# EAGLE design ESP32-S2_Thing_Plus (EAGLE 9.6.2)
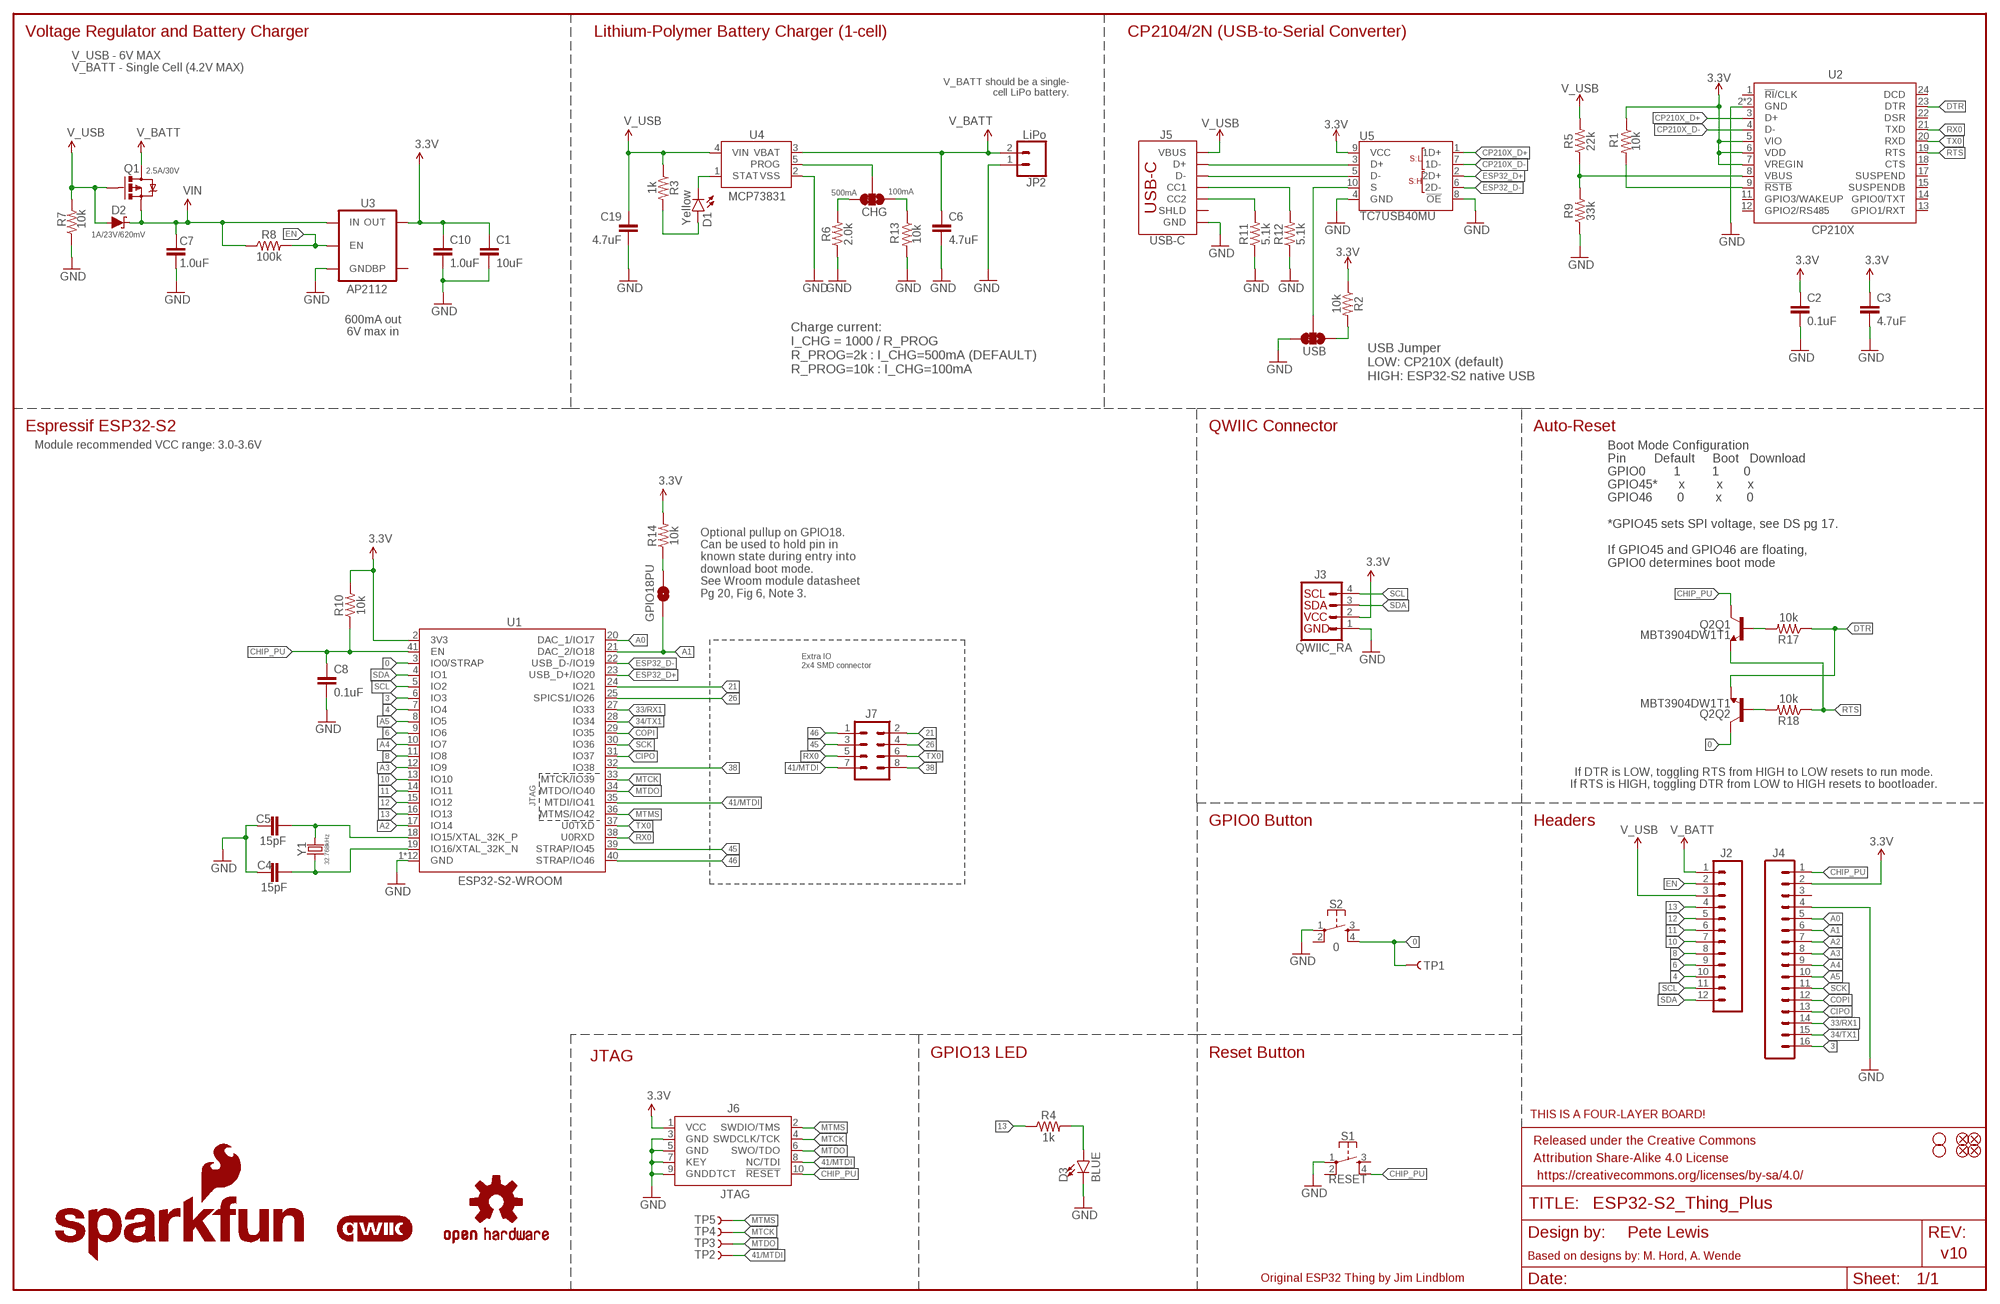
[diagram p0: schematic, sheet 1]

## Parts
C1  10uF  10UF-0402T-6.3V-20%  [0402-TIGHT]
C2  0.1uF  0.1UF-0402T-16V-10%  [0402-TIGHT]
C3  4.7uF  4.7UF-0402_TIGHT-6.3V-20%-X5R  [0402-TIGHT]
C4  15pF  15PF-0402T-50V-5%  [0402-TIGHT]
C5  15pF  15PF-0402T-50V-5%  [0402-TIGHT]
C6  4.7uF  4.7UF-0402_TIGHT-6.3V-20%-X5R  [0402-TIGHT]
C7  1.0uF  1.0UF-0402T-16V-10%  [0402-TIGHT]
C8  0.1uF  0.1UF-0402T-16V-10%  [0402-TIGHT]
C10  1.0uF  1.0UF-0402T-16V-10%  [0402-TIGHT]
C19  4.7uF  4.7UF-0402_TIGHT-6.3V-20%-X5R  [0402-TIGHT]
CHG  JUMPER-SMT_3_1-NC_TRACE_SILK  [SMT-JUMPER_3_1-NC_TRACE_SILK]
D1  Yellow  LED-YELLOW0603  [LED-0603]
D2  1A/23V/620mV  DIODE-SCHOTTKY-BAT20J  [SOD-323]
D3  BLUE  LED-BLUE0603  [LED-0603]
FD1  FIDUCIALUFIDUCIAL  [FIDUCIAL-MICRO]
FD2  FIDUCIALUFIDUCIAL  [FIDUCIAL-MICRO]
FD3  FIDUCIALUFIDUCIAL  [FIDUCIAL-MICRO]
FD4  FIDUCIALUFIDUCIAL  [FIDUCIAL-MICRO]
FRAME1  FRAME-LEDGER  [CREATIVE_COMMONS]
GPIO18PU  JUMPER-SMT_2_NO_SILK  [SMT-JUMPER_2_NO_SILK]
H1  STAND-OFF  [STAND-OFF]
H2  STAND-OFF  [STAND-OFF]
J2  CONN_12SM_SQ_NO_SILK  [1X12_SM_SQ_NOSILK]
J3  QWIIC_RA  QWIIC_CONNECTORJS-1MM  [JST04_1MM_RA]
J4  CONN_161X16_SM_SQ_NOSILK  [1X16_SM_SQ_NOSILK]
J5  USB-C  USB_C_4-LAYER-ISOLATED  [USB-C-16P-4LAYER-ISOLATED]
J6  JTAG  CORTEX_JTAG_DEBUG_PTH_NS  [2X5-PTH-1.27MM-NO_SILK]
J7  CONN_04X2_SMT_NO_POSTS_NS  [2X4_SMT_NO_POSTS_NS]
JP2  LiPo  CONN_02-JST-2MM-SMT  [JST-2-SMD]
LOGO1  SFE_LOGO_FLAME.1_INCH  [SFE_LOGO_FLAME_.1]
LOGO2  OSHW-LOGOMINI  [OSHW-LOGO-MINI]
LOGO3  SFE_LOGO_NAME_FLAME.1_INCH  [SFE_LOGO_NAME_FLAME_.1]
LOGO4  FOUR_LAYER_WARNING  [FOUR_LAYER_WARNING]
LOGO6  QWIIC_LOGO_4MM  [QWIIC_4MM]
Q1  2.5A/30V  MOSFET-PCHANNELDMG2307L  [SOT23-3@1]
Q2  MBT3904DW1T1  TRANS_NPN_DUAL-MBT3904DW1T1  [SC70-6]
R1  10k  10KOHM-0402T-1/16W-1%  [0402-TIGHT]
R2  10k  10KOHM-0402T-1/16W-1%  [0402-TIGHT]
R3  1k  1KOHM-0402T-1/16W-1%  [0402-TIGHT]
R4  1k  1KOHM-0402T-1/16W-1%  [0402-TIGHT]
R5  22k  22KOHM-0402_TIGHT-1/10W-1%  [0402-TIGHT]
R6  2.0k  2.0KOHM1/10W5%(0603)  [0603]
R7  10k  10KOHM-0402T-1/16W-1%  [0402-TIGHT]
R8  100k  100KOHM-0402T-1/16W-1%  [0402-TIGHT]
R9  33k  33KOHM-0402T-1/16W-1%  [0402-TIGHT]
R10  10k  10KOHM-0402T-1/16W-1%  [0402-TIGHT]
R11  5.1k  5.1KOHM-0402T-1/16W-1%  [0402-TIGHT]
R12  5.1k  5.1KOHM-0402T-1/16W-1%  [0402-TIGHT]
R13  10k  10KOHM-0402T-1/16W-1%  [0402-TIGHT]
R14  10k  10KOHM-0402T-1/16W-1%  [0402-TIGHT]
R17  10k  10KOHM-0402T-1/16W-1%  [0402-TIGHT]
R18  10k  10KOHM-0402T-1/16W-1%  [0402-TIGHT]
S1  RESET  MOMENTARY-SWITCH-SPST-2-SMD-4.6X2.8MM  [TACTILE_SWITCH_SMD_4.6X2.8MM]
S2  0  MOMENTARY-SWITCH-SPST-2-SMD-4.6X2.8MM  [TACTILE_SWITCH_SMD_4.6X2.8MM]
TP1  TEST-POINTTP_15TH_THRU  [TP_15TH]
TP2  TEST-POINT3X4  [PAD.03X.04]
TP3  TEST-POINT3X4  [PAD.03X.04]
TP4  TEST-POINT3X4  [PAD.03X.04]
TP5  TEST-POINT3X4  [PAD.03X.04]
U1  ESP32-S2-WROOM  [ESP32-S2-WROOM]
U2  CP210X  CP2102N  [QFN24]
U3  AP2112  V_REG_LDOSMD  [SOT23-5]
U4  MCP73831  [SOT23-5]
U5  TC7USB40MU  [UQFN10]
USB  JUMPER-SMT_3_1-NC_TRACE_SILK  [SMT-JUMPER_3_1-NC_TRACE_SILK]
Y1  32.768kHz  CRYSTAL-32.768KHZSMD-3.2X1.5  [CRYSTAL-SMD-3.2X1.5MM]

## Nets
0: Q2.6(Q2:C) S2.4 TP1.P$1 U1.3(IO0/STRAP)
3: J4.16 U1.6(IO3)
3.3V: C1.1 C2.1 C3.1 C10.1 J3.2 J4.2 J6.1(VCC) R1.1 R2.1 R10.2 R14.2 U1.2(3V3) U2.5(VIO) U2.6(VDD) U2.7(VREGIN) U3.5(OUT) U5.9(VCC)
4: J2.10 U1.7(IO4)
6: J2.9 U1.9(IO6)
8: J2.8 U1.11(IO8)
10: J2.7 U1.13(IO10)
11: J2.6 U1.14(IO11)
12: J2.5 U1.15(IO12)
13: J2.4 R4.1 U1.16(IO13)
21: J7.2 U1.24(IO21)
26: J7.4 U1.25(SPICS1/IO26)
33/RX1: J4.14 U1.27(IO33)
34/TX1: J4.15 U1.28(IO34)
38: J7.8 U1.32(IO38)
41/MTDI: J6.8(NC/TDI) J7.7 TP2.P$1 U1.35(MTDI/IO41)
45: J7.3 U1.39(STRAP/IO45)
46: J7.1 U1.40(STRAP/IO46)
A0: J4.5 U1.20(DAC_1/IO17)
A1: GPIO18PU.1 J4.6 U1.21(DAC_2/IO18)
A2: J4.7 U1.17(IO14)
A3: J4.8 U1.12(IO9)
A4: J4.9 U1.10(IO7)
A5: J4.10 U1.8(IO5)
CC1: J5.A5(CC1) R12.2
CC2: J5.B5(CC2) R11.2
CHG: D1.C U4.1(STAT)
CHIP_PU: C8.1 J4.1 J6.10(!RESET) Q2.3(Q1:C) R10.1 S1.4 U1.41(EN)
CIPO: J4.13 U1.31(IO37)
COPI: J4.12 U1.29(IO35)
CP210X_D+: U2.3(D+) U5.1(1D+)
CP210X_D-: U2.4(D-) U5.7(1D-)
DTR: Q2.1(Q2:E) R17.1 U2.23(DTR)
EN: J2.2 R8.2 U3.3(EN)
ESP32_D+: U1.23(USB_D+/IO20) U5.2(2D+)
ESP32_D-: U1.22(USB_D-/IO19) U5.6(2D-)
GND: C1.2 C2.2 C3.2 C4.1 C5.1 C6.2 C7.2 C8.2 C10.2 C19.2 D3.C J3.1 J4.4 J5.GND J5.GND2(GND) J6.3(GND) J6.5(GND) J6.7(KEY) J6.9(GNDDTCT) JP2.1 R6.1 R7.1 R9.1 R11.1 R12.1 R13.2 S1.1 S2.1 U1.1(GND) U1.26(GND) U1.42(GND) U1.GNDEP0(GND) U1.GNDEP1(GND) U1.GNDEP2(GND) U1.GNDEP3(GND) U1.GNDEP4(GND) U1.GNDEP5(GND) U1.GNDEP6(GND) U1.GNDEP7(GND) U1.GNDEP8(GND) U2.2(GND) U2.PAD(GND) U3.2(GND) U4.2(VSS) U5.4(GND) U5.8(!OE!) USB.3
MTCK: J6.4(SWDCLK/TCK) TP4.P$1 U1.33(MTCK/IO39)
MTDO: J6.6(SWO/TDO) TP3.P$1 U1.34(MTDO/IO40)
MTMS: J6.2(SWDIO/TMS) TP5.P$1 U1.36(MTMS/IO42)
N$1: R1.2 U2.9(!RSTB)
N$2: D3.A R4.2
N$3: J5.A6(D+) J5.B6(D+) U5.3(D+)
N$4: R5.1 R9.2 U2.8(VBUS)
N$5: J5.A7(D-) J5.B7(D-) U5.5(D-)
N$6: R2.2 USB.1
N$7: C5.2 U1.18(IO15/XTAL_32K_P) Y1.P$2
N$8: C4.2 U1.19(IO16/XTAL_32K_N) Y1.P$1
N$9: CHG.2 U4.5(PROG)
N$10: Q2.5(Q1:B) R17.2
N$11: CHG.1 R13.1
N$12: Q2.2(Q2:B) R18.2
N$13: CHG.3 R6.2
N$14: GPIO18PU.2 R14.1
N$17: D1.A R3.2
RTS: Q2.4(Q1:E) R18.1 U2.19(RTS)
RX0: J7.5 U1.38(U0RXD) U2.21(TXD)
SCK: J4.11 U1.30(IO36)
SCL: J2.11 J3.4 U1.5(IO2)
SDA: J2.12 J3.3 U1.4(IO1)
TX0: J7.6 U1.37(U0TXD) U2.20(RXD)
USB_SEL: U5.10(S) USB.2
V_BATT: C6.1 J2.1 JP2.2 Q1.3(D) U4.3(VBAT)
V_USB: C19.1 D2.A J2.3 J5.VBUS1(VBUS) J5.VBUS2(VBUS) Q1.1(G) R3.1 R5.2 R7.2 U4.4(VIN)
VIN: C7.1 D2.C Q1.2(S) R8.1 U3.1(IN)
Unconnected: J4.3 J5.SHLD1(SHLD) J5.SHLD2(SHLD) J5.SHLD3(SHLD) J5.SHLD4(SHLD) J5.SHLD5(SHLD) J5.SHLD6(SHLD) J5.SHLD7(SHLD) J5.SHLD8(SHLD) S1.2 S1.3 S2.2 S2.3 U2.1(!RI!/CLK) U2.11(GPIO3/WAKEUP) U2.12(GPIO2/RS485) U2.13(GPIO1/RXT) U2.14(GPIO0/TXT) U2.15(SUSPENDB) U2.17(SUSPEND) U2.18(CTS) U2.22(DSR) U2.24(DCD) U3.4(BP)

## Notes on the sheet
- Voltage Regulator and Battery Charger | Lithium-Polymer Battery Charger (1-cell) | CP2104/2N (USB-to-Serial Converter)
- V_USB - 6V MAX
  V_BATT - Single Cell (4.2V MAX)
- V_BATT should be a single-
  cell LiPo battery.
- 500mA | 100mA
- 600mA out
  6V max in
- Charge current:
  I_CHG = 1000 / R_PROG
  R_PROG=2k : I_CHG=500mA (DEFAULT)
  R_PROG=10k : I_CHG=100mA
- USB Jumper
  LOW: CP210X (default)
  HIGH: ESP32-S2 native USB
- Espressif ESP32-S2 | QWIIC Connector | Auto-Reset
- Module recommended VCC range: 3.0-3.6V
- Boot Mode Configuration
  Pin        Default     Boot   Download
  GPIO0        1         1       0
  GPIO45*      x         x       x 
  GPIO46       0         x       0
  
  *GPIO45 sets SPI voltage, see DS pg 17.
  
  If GPIO45 and GPIO46 are floating, 
  GPIO0 determines boot mode
- Optional pullup on GPIO18.
  Can be used to hold pin in 
  known state during entry into
  download boot mode. 
  See Wroom module datasheet
  Pg 20, Fig 6, Note 3.
- Extra IO 
  2x4 SMD connector
- If DTR is LOW, toggling RTS from HIGH to LOW resets to run mode.
  If RTS is HIGH, toggling DTR from LOW to HIGH resets to bootloader.
- GPIO0 Button | Headers
- JTAG | GPIO13 LED | Reset Button
- Pete Lewis
- v10
- Based on designs by: M. Hord, A. Wende
- Original ESP32 Thing by Jim Lindblom

## Library data of the parts
C1 = SparkFun-Capacitors:10UF: 10.0µF ceramic capacitors A capacitor is a passive two-terminal electrical component used to store electrical energy temporarily in an electric field.; PROD_ID: CAP-14848
C2 C8 = SparkFun-Capacitors:0.1UF: 0.1µF ceramic capacitors A capacitor is a passive two-terminal electrical component used to store electrical energy temporarily in an electric field.; PROD_ID: CAP-12416
C3 C6 C19 = SparkFun-Capacitors:4.7UF: 4.7µF ceramic capacitors A capacitor is a passive two-terminal electrical component used to store electrical energy temporarily in an electric field.; PROD_ID: CAP-14240
C4 C5 = SparkFun-Capacitors:15PF: 15pF ceramic capacitors A capacitor is a passive two-terminal electrical component used to store electrical energy temporarily in an electric field.; PROD_ID: CAP-13063
C7 C10 = SparkFun-Capacitors:1.0UF: 1µF ceramic capacitors A capacitor is a passive two-terminal electrical component used to store electrical energy temporarily in an electric field.; PROD_ID: CAP-12417
CHG USB = SparkFun-Jumpers:JUMPER-SMT_3_1-NC_TRACE: Normally closed trace jumper (1 of 2 connections) This jumper has a trace between two pads so it's normally closed (NC). The other connection is normally open (NO). Use a razor knife to open the connection. For best results follow the IPC guidelines for cutting traces: Cutout at least 0.063 mm (0.005 in). Remove all loose material to clean up the cut area. Seal the cut with an approved epoxy. Reapply solder to reclose the connection, or to close the NO connection.
D1 = SparkFun-LED:LED-YELLOW: Yellow SMD LED Used in manufacturing several products at SparkFun. Packages: 0603 - SMD 0603 package[Product Link] <http://www.kingbrightusa.com/product.asp?catalog_name=LED&product_id=APT1608SYCK> 0603 -SMART - SMART SMD 0603 package (more efficient/more expensive) [Product Link] <http://www.osram-os.com/osram_os/en/products/product-catalog/led-light-emitting-diodes/smartled-0603/ly-l29k/index.jsp> LilyPad - SMD1206 package[Product Datasheet] <https://www.sparkfun.com/datasheets/DevTools/LilyPad/Q150YUS4.pdf> SparkFun Products: Blynk Board <https://www.sparkfun.com/products/13794> IOIO-OTG <https://www.sparkfun.com/products/13613> XBee Explorer Serial <https://www.sparkfun.com/products/13225>; PROD_ID: DIO-09003
D2 = SparkFun-DiscreteSemi:DIODE-SCHOTTKY: Schottky diode A Schottky diode is a semiconductor diode which has a low forward voltage drop and a very fast switching action.; PROD_ID: DIO-11623
D3 = SparkFun-LED:LED-BLUE: Blue SMD LED Used in manufacturing of various products at SparkFun Packages: 0603 - SMD 0603 package [Product Link] <http://www.digikey.com/product-detail/en/SMLE12BC7TT86/511-1589-2-ND/1641808> 1206 - SMD1206 package [Product Link] <http://www.digikey.com/product-detail/en/lite-on-inc/LTST-C150TBKT/160-1643-1-ND/573584> SparkFun Products: ESP8266 Thing-Dev Board <https://www.sparkfun.com/products/13711> RedBoard <https://www.sparkfun.com/products/12757>; PROD_ID: DIO-08575
FD1-FD4 = SparkFun-Aesthetics:FIDUCIAL: Fiducial Alignment Points Point-of-reference for pick-and-place machines and other optical instruments.
FRAME1 = SparkFun-Aesthetics:FRAME-LEDGER: Schematic Frame - Ledger Standard 11x14 US Ledger frame
GPIO18PU = SparkFun-Jumpers:JUMPER-SMT_2_NO: Normally open jumper This jumper has two pads in close proximity to each other. Apply solder to close the connection. Round pads are easier to solder for beginners, but are a lot larger. SparkFun Product that uses the round pads: SparkFun EL Sequencer <https://www.sparkfun.com/products/12781>
H1 H2 = SparkFun-Hardware:STAND-OFF: Stand Off Drill holes for mechanically mounting via screws, standoffs, etc. Note: Use the keepout ring to avoid running the screw head into surrounding components. Variant Overviews STAND-OFF - Mechanical footprint for a #4 phillips button head screw. STAND-OFF-TIGHT - Mechanical footprint for a #4 phillips button head screw, Example SparkFun Products Screw - Phillips Head (1/4", 4-40, 10 pack) <https://www.sparkfun.com/products/10453> (PRT-10453) Screw - Phillips Head (1/2", 4-40, 10 pack) <https://www.sparkfun.com/products/10452> (PRT-10452) Screw - Phillips Head (3/4", 4-40, 10 pack) <https://www.sparkfun.com/products/10451> (PRT-10451) Screw - Phillips Head (1", 4-40, 10 pack) <https://www.sparkfun.com/products/10450> (PRT-10450)
J2 = SparkFun-Connectors:CONN_12: Multi connection point. Often used as Generic Header-pin footprint for 0.1 inch spaced/style header connections On any of the 0.1 inch spaced packages, you can populate with these: Break Away Headers - Straight <https://www.sparkfun.com/products/116> (PRT-00116) Break Away Male Headers - Right Angle <https://www.sparkfun.com/products/553> (PRT-00553) Female Headers <https://www.sparkfun.com/products/115> (PRT-00115) Break Away Headers - Machine Pin <https://www.sparkfun.com/products/117> (PRT-00117) Break Away Female Headers - Swiss Machine Pin <https://www.sparkfun.com/products/743> (PRT-00743) For SCREWTERMINALS and SPRING TERMINALS visit here: Screw Terimnals on SparkFun.com <https://www.sparkfun.com/search/results?term=Screw+Terminals> (5mm/3.5mm/2.54mm spacing) This device is also useful as a general connection point to wire up your design to another part of your project. Our various solder wires solder well into these plated through hole pads. Hook-Up Wire - Assortment (Stranded, 22 AWG) <https://www.sparkfun.com/products/11375> (PRT-11375) Hook-Up Wire - Assortment (Solid Core, 22 AWG) <https://www.sparkfun.com/products/11367> (PRT-11367) View the entire wire category on our website here <https://www.sparkfun.com/categories/141> Special notes: Molex polarized connector foot print use with SKU : PRT-08231 with associated crimp pins and housings. 1MM SMD Version SKU: PRT-10208 NOTES ON THE VARIANTS LOCK and LOCK_LONGPADS... This footprint was designed to help hold the alignment of a through-hole component (i.e. 6-pin header) while soldering it into place. You may notice that each hole has been shifted either up or down by 0.005 of an inch from it's more standard position (which is a perfectly straight line). This slight alteration caused the pins (the squares in the middle) to touch the edges of the holes. Because they are alternating, it causes a "brace" to hold the component in place. 0.005 has proven to be the perfect amount of "off-center" position when using our standard breakaway headers. Although looks a little odd when you look at the bare footprint, once you have a header in there, the alteration is very hard to notice. Also,if you push a header all the way into place, it is covered up entirely on the bottom side.
J3 = SparkFun-Connectors:QWIIC_CONNECTOR: SparkFun I2C Standard Qwiic Connector An SMD 1mm pitch JST connector makes it easy and quick (get it? Qwiic?) to connect I2C devices to each other. The Qwiic system <http://www.sparkfun.com/qwiic> enables fast and solderless connection between popular platforms and various sensors and actuators. We carry 200mm <https://www.sparkfun.com/products/14204>, 100mm <https://www.sparkfun.com/products/14205>, 50mm <https://www.sparkfun.com/products/14206>, and breadboard friendly <https://www.sparkfun.com/products/14207> Qwiic cables. We also offer 10 pcs strips <https://www.sparkfun.com/products/14323> the SMD connectors.; PROD_ID: CONN-13694; VALUE: QWIIC_RIGHT_ANGLE
J4 = SparkFun-Connectors:CONN_16: Multi connection point. Often used as Generic Header-pin footprint for 0.1 inch spaced/style header connections On any of the 0.1 inch spaced packages, you can populate with these: Break Away Headers - Straight <https://www.sparkfun.com/products/116> (PRT-00116) Break Away Male Headers - Right Angle <https://www.sparkfun.com/products/553> (PRT-00553) Female Headers <https://www.sparkfun.com/products/115> (PRT-00115) Break Away Headers - Machine Pin <https://www.sparkfun.com/products/117> (PRT-00117) Break Away Female Headers - Swiss Machine Pin <https://www.sparkfun.com/products/743> (PRT-00743) For SCREWTERMINALS and SPRING TERMINALS visit here: Screw Terimnals on SparkFun.com <https://www.sparkfun.com/search/results?term=Screw+Terminals> (5mm/3.5mm/2.54mm spacing) This device is also useful as a general connection point to wire up your design to another part of your project. Our various solder wires solder well into these plated through hole pads. Hook-Up Wire - Assortment (Stranded, 22 AWG) <https://www.sparkfun.com/products/11375> (PRT-11375) Hook-Up Wire - Assortment (Solid Core, 22 AWG) <https://www.sparkfun.com/products/11367> (PRT-11367) View the entire wire category on our website here <https://www.sparkfun.com/categories/141> Special notes: Molex polarized connector foot print use with SKU : PRT-08231 with associated crimp pins and housings. 1MM SMD Version SKU: PRT-10208 NOTES ON THE VARIANTS LOCK and LOCK_LONGPADS... This footprint was designed to help hold the alignment of a through-hole component (i.e. 6-pin header) while soldering it into place. You may notice that each hole has been shifted either up or down by 0.005 of an inch from it's more standard position (which is a perfectly straight line). This slight alteration caused the pins (the squares in the middle) to touch the edges of the holes. Because they are alternating, it causes a "brace" to hold the component in place. 0.005 has proven to be the perfect amount of "off-center" position when using our standard breakaway headers. Although looks a little odd when you look at the bare footprint, once you have a header in there, the alteration is very hard to notice. Also,if you push a header all the way into place, it is covered up entirely on the bottom side.
J5 = SparkFun-Connectors:USB_C: USB Type C 16Pin Connector Super Speed pins not available on the 16-pin purely SMD connector so this part is best for USB 2.0 implementations. D1 and D2 are tied together enabling D+/- no matter which way the cable is plugged into the connector. The two channel configuration pins (CC1/2) are exposed. These are normally connected to ground via 5.1k resistors but can be reconfigured for high current/high power applications. **4-LAYER BOARD WARNING!!** If designing 4-layer board, make sure to select the variant _4-LAYER-ISOLATED. The linked footprint (USB-C-16-4LAYER-ISOLATED) includes some very necessary cutout polygons in the inner layers (2 and 15). This prevents the PTH mounting shield legs on the USB connector from electrically connecting any other polygons on the inner layers (usually VCC and GND).; PROD_ID: CONN-14122; VALUE: USB Female Type C Connector
J6 = SparkFun-Connectors:CORTEX_JTAG_DEBUG: Cortex Debug Connector - 10 pin Supports JTAG debug, Serial Wire debug, and Serial Wire Viewer. PTH and SMD connector options available. General Connector Information <http://infocenter.arm.com/help/topic/com.arm.doc.faqs/attached/13634/cortex_debug_connectors.pdf> Products: PTH Connector <http://www.digikey.com/product-detail/en/cnc-tech/3220-10-0100-00/1175-1627-ND/3883661> -via Digi-Key SparkFun PSoc <https://www.sparkfun.com/products/13229> SparkFun T <https://www.sparkfun.com/products/13810>
J7 = SparkFun-Connectors:CONN_04X2: Multi connection point. Often used as Generic Header-pin footprint for 0.1 inch spaced/style header connections On any of the 0.1 inch spaced packages, you can populate with these: Break Away Headers - Straight <https://www.sparkfun.com/products/116> (PRT-00116) Break Away Male Headers - Right Angle <https://www.sparkfun.com/products/553> (PRT-00553) Female Headers <https://www.sparkfun.com/products/115> (PRT-00115) Break Away Headers - Machine Pin <https://www.sparkfun.com/products/117> (PRT-00117) Break Away Female Headers - Swiss Machine Pin <https://www.sparkfun.com/products/743> (PRT-00743)
JP2 = SparkFun-Connectors:CONN_02: Multi connection point. Often used as Generic Header-pin footprint for 0.1 inch spaced/style header connections On any of the 0.1 inch spaced packages, you can populate with these: Break Away Headers - Straight <https://www.sparkfun.com/products/116> (PRT-00116) Break Away Male Headers - Right Angle <https://www.sparkfun.com/products/553> (PRT-00553) Female Headers <https://www.sparkfun.com/products/115> (PRT-00115) Break Away Headers - Machine Pin <https://www.sparkfun.com/products/117> (PRT-00117) Break Away Female Headers - Swiss Machine Pin <https://www.sparkfun.com/products/743> (PRT-00743) For SCREWTERMINALS and SPRING TERMINALS visit here: Screw Terimnals on SparkFun.com <https://www.sparkfun.com/search/results?term=Screw+Terminals> (5mm/3.5mm/2.54mm spacing) This device is also useful as a general connection point to wire up your design to another part of your project. Our various solder wires solder well into these plated through hole pads. Hook-Up Wire - Assortment (Stranded, 22 AWG) <https://www.sparkfun.com/products/11375> (PRT-11375) Hook-Up Wire - Assortment (Solid Core, 22 AWG) <https://www.sparkfun.com/products/11367> (PRT-11367) View the entire wire category on our website here <https://www.sparkfun.com/categories/141> Special notes: Molex polarized connector foot print use with: PRT-08233 with associated crimp pins and housings. 2.54_SCREWTERM for use with PRT-10571. 3.5mm Screw Terminal footprints for PRT-08084 5mm Screw Terminal footprints for use with PRT-08432; PROD_ID: CONN-11443
LOGO1 = SparkFun-Aesthetics:SFE_LOGO_FLAME: SparkFun Flame Logo This is the SparkFun flame logo. The logo on the schematic will always be the same size; the package variant is the height of the flame. Default layer for the logo on the board is tSilk.
LOGO2 = SparkFun-Aesthetics:OSHW-LOGO: Open-Source Hardware (OSHW) Logo This logo indicates the piece of hardware it is found on incorporates a OSHW license and/or adheres to the definition of open source hardware found here: http://freedomdefined.org/OSHW
LOGO3 = SparkFun-Aesthetics:SFE_LOGO_NAME_FLAME: SparkFun Font Logo w/ Flame This is the SparkFun full logo. The logo on the schematic will always be the same size; the package variant is the height of the flame part of the logo. Default layer for the logo on the board is tSilk.
LOGO4 = SparkFun-Aesthetics:FOUR_LAYER_WARNING: Four-Layer Board Warning - tDoc Layer Warning text which will appear on both the schematic and the board file, notifying viewers that the design is a four-layer PCB.
LOGO6 = SparkFun-Aesthetics:QWIIC_LOGO: Qwiic Logos for placement on schematic and PCB. The 5.5mm silk logo is best for placing next to Qwiic connector.
Q1 = SparkFun-DiscreteSemi:MOSFET-PCHANNEL: Generic PMOSFET IRLML2244 - TRANS-11153 (SOT-23 -20V -4.3A) (1.Gate 2.Source 3.Drain) FQP27P06 - COM-10349 <http://www.sparkfun.com/products/10349> (TO-220 -60V -27A) (1.Gate 2.Source 3.Drain); PROD_ID: TRANS-11308
Q2 = SparkFun-DiscreteSemi:TRANS_NPN_DUAL: Dual NPN Transistors in Single Package The MBT3904W1 puts two general purpose 3904 NPN transistors in a single package. Datasheet <http://www.onsemi.com/pub_link/Collateral/MBT3904DW1T1-D.PDF> SparkFun Products: SparkFun ESP32 Thing <https://www.sparkfun.com/products/13907>; PROD_ID: TRANS-13337
R1 R2 R7 R10 R13 R14 R17 R18 = SparkFun-Resistors:10KOHM: 10kΩ resistor A resistor is a passive two-terminal electrical component that implements electrical resistance as a circuit element. Resistors act to reduce current flow, and, at the same time, act to lower voltage levels within circuits. - Wikipedia; PROD_ID: RES-14241
R3 R4 = SparkFun-Resistors:1KOHM: 1kΩ resistor A resistor is a passive two-terminal electrical component that implements electrical resistance as a circuit element. Resistors act to reduce current flow, and, at the same time, act to lower voltage levels within circuits. - Wikipedia; PROD_ID: RES-14342
R5 = SparkFun-Resistors:22KOHM: 22kΩ resistor A resistor is a passive two-terminal electrical component that implements electrical resistance as a circuit element. Resistors act to reduce current flow, and, at the same time, act to lower voltage levels within circuits. - Wikipedia; PROD_ID: RES-14281
R6 = SparkFun-Resistors:2.0KOHM1/10W5%(0603): RES-08296; PROD_ID: RES-08296
R8 = SparkFun-Resistors:100KOHM: 100kΩ resistor A resistor is a passive two-terminal electrical component that implements electrical resistance as a circuit element. Resistors act to reduce current flow, and, at the same time, act to lower voltage levels within circuits. - Wikipedia; PROD_ID: RES-13495
R9 = SparkFun-Resistors:33KOHM: 33kΩ resistor A resistor is a passive two-terminal electrical component that implements electrical resistance as a circuit element. Resistors act to reduce current flow, and, at the same time, act to lower voltage levels within circuits. - Wikipedia; PROD_ID: RES-15128
R11 R12 = SparkFun-Resistors:5.1KOHM; PROD_ID: RES-14340
S1 S2 = SparkFun-Switches:MOMENTARY-SWITCH-SPST-2: Momentary Switch (Pushbutton) - SPST - Two Circuits Normally-open (NO) SPST momentary switches (buttons, pushbuttons). Schematic symbol includes two switch circuits. Variants SMD-4.6MMX2.8MM - 4.60mm x 2.80mm Tactile Momentary Button Switch - Used on SparkFun SAMD21 Mini Breakout <https://www.sparkfun.com/products/13664> SMD-5.2MM - Mini Pushbutton Switch - SMD <https://www.sparkfun.com/products/8720> - Used on Arduino Pro Mini <https://www.sparkfun.com/products/11114>; PROD_ID: SWCH-15606
TP1-TP5 = SparkFun-Connectors:TEST-POINT: SparkFun Test Points Bare copper test points for troubleshooting or In-Circuit-Testing. These are used by our Production team for verifying production board runs using pogo-pins on test beds. SparkFun Products: SparkFun LSM9DS1 Breakout <https://www.sparkfun.com/products/13284> SparkFun PSOC <https://www.sparkfun.com/products/13714> SparkFun Load Cell Amplifier <https://www.sparkfun.com/products/13879>
U1 = esp32-s2-wroom:ESP32-S2-WROOM: ESP32-S2-WROOM - trace antenna (includes keepout); PROD_ID: IC-15599
U2 = SparkFun-IC-Comms:CP2102N; PROD_ID: IC-14020
U3 = SparkFun-PowerIC:V_REG_LDO: Voltage Regulator LDO Standard 150mA LDO voltage regulator in SOT-23 layout. Micrel part MIC5205. BP (by-pass) pin is used to lower output noise with 470pF cap.; PROD_ID: VREG-12457
U4 = SparkFun-PowerIC:MCP73831: Miniature single cell, fully integrated Li-Ion, Li-polymer charge management controller http://ww1.microchip.com/downloads/en/DeviceDoc/20001984g.pdf IC-09995; PROD_ID: IC-09995
U5 = esp32-s2-wroom:TC7USB40MU: TC7USB40MU Dual SPDT USB Switch The TC7USB40MU is high-speed CMOS dual 1-2 multiplexer/demultiplexer. The low ON-resistance and the low capacitance of the switch allow connections to USB2.0 (480Mbps) application.; PROD_ID: IC-15600
Y1 = SparkFun-Clocks:CRYSTAL-32.768KHZ: 32.768kHz Crystal Frequency: 32.768kHz Frequency Stability: ±20ppm Load Capacitance: 12.5pF (PTH-2X6 & SMD-3.2X1.5), 6pF (SMD-2X6) SparkFun Products: SparkFun BigTime Watch Kit <https://www.sparkfun.com/products/11734> SparkFun nRF52832 Breakout <https://www.sparkfun.com/products/13990> SparkFun Real Time Clock Module <https://www.sparkfun.com/products/12708>; PROD_ID: XTAL-13062

## Board
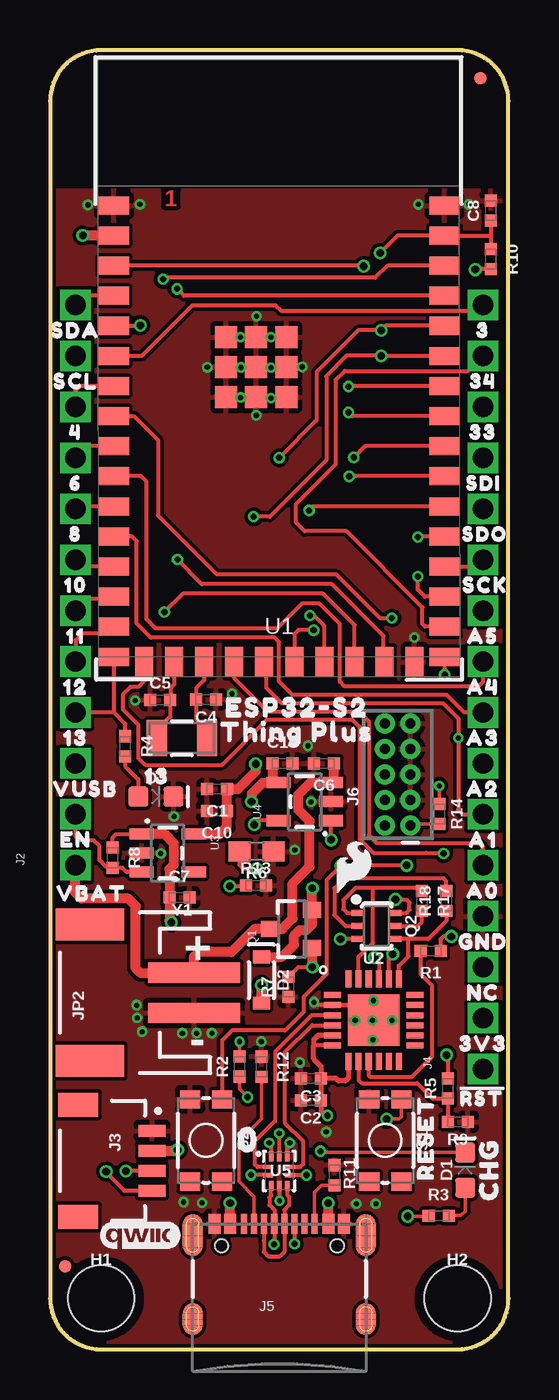
[diagram p1: board, top side]
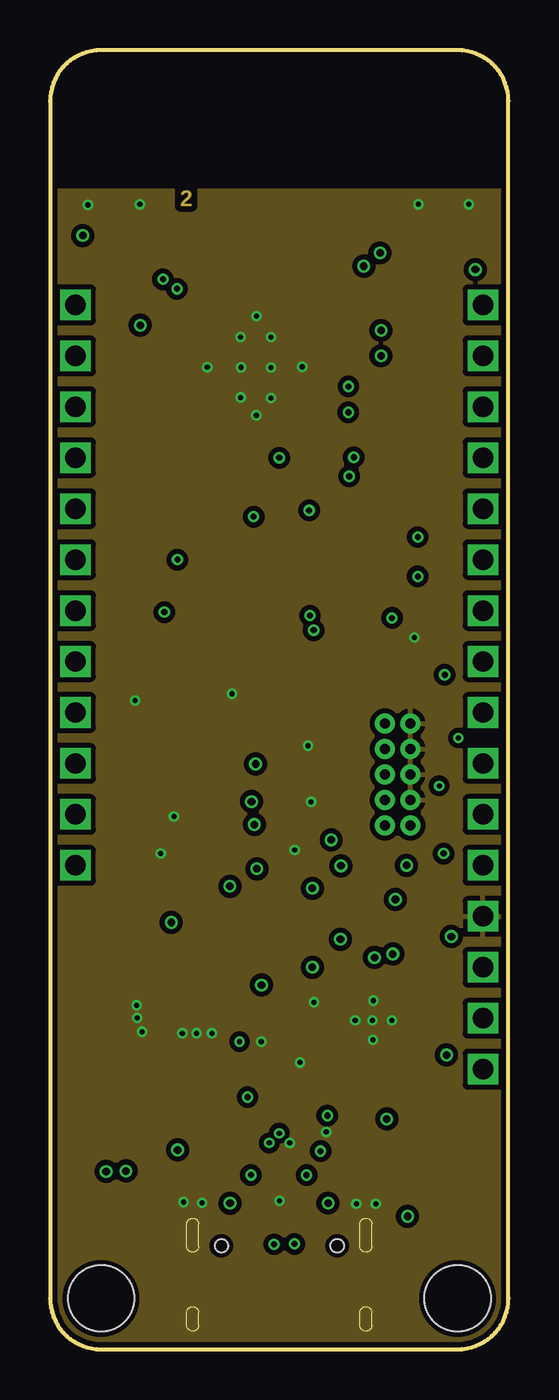
[diagram p2: board, inner layer Route2]
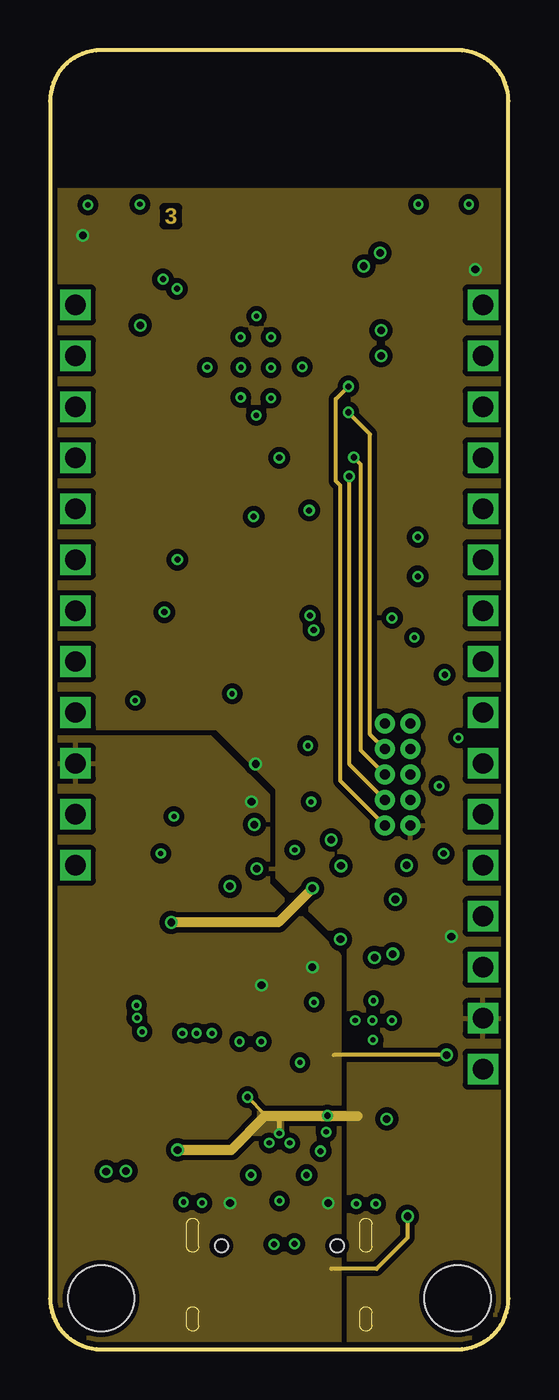
[diagram p3: board, inner layer Route15]
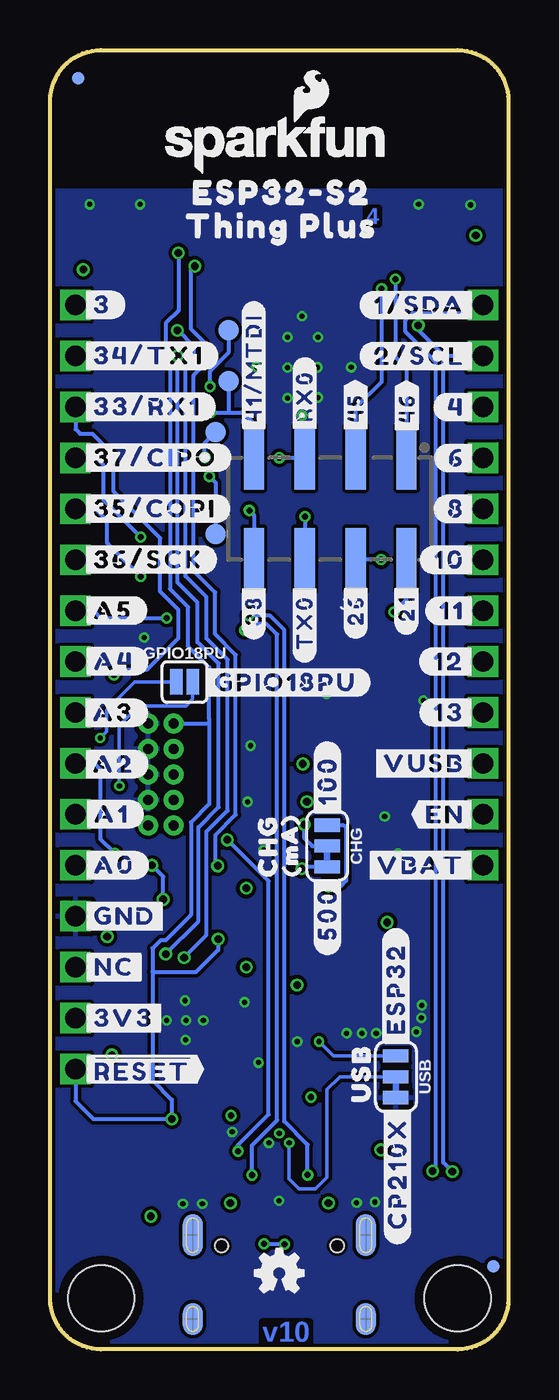
[diagram p4: board, bottom side, seen from below]

Size 22.86 x 64.77 mm. Coordinates in mm from the lower left corner, seen from the top.
Outline: 22.86,2.54 22.86,62.23 arc90 20.32,64.77 2.54,64.77 arc90 0,62.23 0,2.54 arc90 2.54,0 20.32,0 arc90 22.86,2.54
Copper layers (1*2*15*16): Top 0.035559375mm / dielectric 0.47751875mm / Route2 0.035559375mm / dielectric 0.47751875mm / Route15 0.035559375mm / dielectric 0.47751875mm / Bottom 0.035559375mm
Design rules "SparkFun-4-Layer-Minimum-JLCPCB *": minimum track width 5mil, minimum drill 0.2mm, track to track 5mil, track to pad 5mil, pad to pad 5mil, via to via 5mil, smd to smd 5mil, copper to edge 7mil, drill to drill 7mil, minimum pad ring 5mil, minimum via ring 5mil, stop-mask expansion 2.5mil, vias tented up to drill 25mil, thermal gap 10mil
tRestrict: area 17.5,16.3 to 17.6,16.5; area 14.7,16.3 to 14.8,16.6; area 16,15 to 16.3,15.1; area 16,17.8 to 16.2,17.8

### Footprints (pad centres in the part's own frame; a part is rotated, then mirrored left to right if it is on the bottom)
0402-TIGHT = smd 0.6 x 0.6: 1 -0.5,0; 2 0.5,0
SMT-JUMPER_3_1-NC_TRACE_SILK = smd 0.66 x 1.27: 1 -1.041,0; 2 0,0; 3 1.041,0
LED-0603 = smd 1 x 1: A -0.877,0; C 0.877,0
SOD-323 = smd 0.63 x 0.83: A 1.15,0; C -1.15,0
FIDUCIAL-MICRO = smd 0.635 x 0.635: 1 0,0
SMT-JUMPER_2_NO_SILK = smd 0.635 x 1.27: 1 -0.406,0; 2 0.406,0
STAND-OFF = hole 3.302: 0,0
1X12_SM_SQ_NOSILK = drill 1.016 pad 1.27 square: 1 0,0; 2 2.54,0; 3 5.08,0; 4 7.62,0; 5 10.16,0; 6 12.7,0; 7 15.24,0; 8 17.78,0; 9 20.32,0; 10 22.86,0; 11 25.4,0; 12 27.94,0
JST04_1MM_RA = smd 0.6 x 1.35: 1 -1.5,0; 2 -0.5,0; 3 0.5,0; 4 1.5,0 | smd 1.2 x 2: NC1 2.8,-3.675; NC2 -2.8,-3.675
1X16_SM_SQ_NOSILK = drill 1.016 pad 1.27 square: 1 0,0; 2 2.54,0; 3 5.08,0; 4 7.62,0; 5 10.16,0; 6 12.7,0; 7 15.24,0; 8 17.78,0; 9 20.32,0; 10 22.86,0; 11 25.4,0; 12 27.94,0; 13 30.48,0; 14 33.02,0; 15 35.56,0; 16 38.1,0
USB-C-16P-4LAYER-ISOLATED = smd 0.3 x 1: A5 -1.25,-0.34; A6 -0.25,-0.34; A7 0.25,-0.34; A8 1.25,-0.34; B5 1.75,-0.34; B6 0.75,-0.34; B7 -0.75,-0.34; B8 -1.75,-0.34 | smd 0.6 x 1: GND -3.225,-0.34; GND2 3.225,-0.34; VBUS1 -2.45,-0.34; VBUS2 2.45,-0.34 | smd 1 x 2.1: SHLD1 -4.32,-0.915; SHLD2 4.32,-0.915 | smd 1 x 2.1 bottom: SHLD3 -4.32,-0.915; SHLD4 4.32,-0.915 | smd 1 x 1.6: SHLD5 -4.32,-5.095; SHLD8 4.32,-5.095 | smd 1 x 1.6 bottom: SHLD6 -4.32,-5.095; SHLD7 4.32,-5.095 | hole 0.65: -2.89,-1.445; 2.89,-1.445
2X5-PTH-1.27MM-NO_SILK = drill 0.508 pad 1: 1 -2.54,-0.635; 2 -2.54,0.635; 3 -1.27,-0.635; 4 -1.27,0.635; 5 0,-0.635; 6 0,0.635; 7 1.27,-0.635; 8 1.27,0.635; 9 2.54,-0.635; 10 2.54,0.635
2X4_SMT_NO_POSTS_NS = smd 1 x 3.17: 1 -3.81,-2.54; 2 -3.81,2.54; 3 -1.27,-2.54; 4 -1.27,2.54; 5 1.27,-2.54; 6 1.27,2.54; 7 3.81,-2.54; 8 3.81,2.54
JST-2-SMD = smd 1 x 4.6: 1 -1,-3.7; 2 1,-3.7 | smd 1.6 x 3.4: NC1 -3.4,1.5; NC2 3.4,1.5
SOT23-3@1 = smd 0.8 x 0.9: 1 -0.95,-1; 2 0.95,-1; 3 0,1.1
SC70-6 = smd 0.3 x 0.66: 1 -0.65,-0.92; 2 0,-0.92; 3 0.65,-0.92; 4 0.65,0.92; 5 0,0.92; 6 -0.65,0.92
0603 = smd 1.1 x 1: 1 -0.85,0; 2 0.85,0
TACTILE_SWITCH_SMD_4.6X2.8MM = smd 0.9 x 1: 1 -2.05,-0.8; 2 2.05,-0.8; 3 2.05,0.8; 4 -2.05,0.8
TP_15TH = drill 0.381 pad 0.61: P$1 0,0
PAD.03X.04 = smd 1.016 x 1.016: P$1 0,0
ESP32-S2-WROOM = smd 0.9 x 1.5: 1 11.94,8.25; 2 10.44,8.25; 3 8.94,8.25; 4 7.44,8.25; 5 5.94,8.25; 6 4.44,8.25; 7 2.94,8.25; 8 1.44,8.25; 9 -0.06,8.25; 10 -1.56,8.25; 11 -3.06,8.25; 12 -4.56,8.25; 13 -6.06,8.25; 14 -7.56,8.25; 15 -9.06,8.25; 16 -10.56,8.25; 27 -10.56,-8.24; 28 -9.06,-8.24; 29 -7.56,-8.24; 30 -6.06,-8.24; 31 -4.56,-8.24; 32 -3.06,-8.24; 33 -1.56,-8.24; 34 -0.06,-8.24; 35 1.44,-8.24; 36 2.94,-8.24; 37 4.44,-8.24; 38 5.94,-8.24; 39 7.44,-8.24; 40 8.94,-8.24; 41 10.44,-8.24; 42 11.94,-8.24 | smd 1.5 x 0.9: 17 -10.82,6.75; 18 -10.82,5.25; 19 -10.82,3.75; 20 -10.82,2.25; 21 -10.82,0.75; 22 -10.82,-0.75; 23 -10.82,-2.25; 24 -10.82,-3.75; 25 -10.82,-5.25; 26 -10.82,-6.75 | smd 1.1 x 1.1: GNDEP0 3.88,1.15; GNDEP1 5.38,-0.35; GNDEP2 5.38,1.15; GNDEP3 5.38,2.65; GNDEP4 3.88,2.65; GNDEP5 2.38,2.65; GNDEP6 2.38,1.15; GNDEP7 2.38,-0.35; GNDEP8 3.88,-0.35
QFN24 = smd 0.85 x 0.3: 1 -2.05,1.25; 2 -2.05,0.75; 3 -2.05,0.25; 4 -2.05,-0.25; 5 -2.05,-0.75; 6 -2.05,-1.25; 13 2.05,-1.25; 14 2.05,-0.75; 15 2.05,-0.25; 16 2.05,0.25; 17 2.05,0.75; 18 2.05,1.25 | smd 0.3 x 0.85: 7 -1.25,-2.05; 8 -0.75,-2.05; 9 -0.25,-2.05; 10 0.25,-2.05; 11 0.75,-2.05; 12 1.25,-2.05; 19 1.25,2.05; 20 0.75,2.05; 21 0.25,2.05; 22 -0.25,2.05; 23 -0.75,2.05; 24 -1.25,2.05 | smd 2.55 x 2.55: PAD 0,0
SOT23-5 = smd 0.55 x 1.2: 1 -0.95,-1.3; 2 0,-1.3; 3 0.95,-1.3; 4 0.95,1.3; 5 -0.95,1.3
UQFN10 = smd 0.5 x 0.205: 1 -0.555,0.2; 2 -0.552,-0.2; 6 0.54,-0.2; 7 0.54,0.2 | smd 0.205 x 0.5: 3 -0.4,-0.74; 4 0,-0.74; 5 0.4,-0.74; 8 0.4,0.74; 9 0,0.743; 10 -0.4,0.743
CRYSTAL-SMD-3.2X1.5MM = smd 1 x 1.8: P$1 -1.25,0; P$2 1.25,0

### Placement (x,y rotation side)
C1  8.33,27.93 180 top
C2  13.01,12.42 180 top
C3  13.01,13.51 180 top
C4  7.78,32.4 180 top
C5  5.49,32.36 0 top
C6  13.66,29.2 180 top
C7  6.45,22.53 0 top
C8  21.97,56.77 90 top
C10  8.32,26.84 180 top
C19  11.6,29.21 0 top
CHG  9.04,25.1 270 bottom
D1  20.7,8.94 90 top
D2  10.54,18.41 270 top
D3  5.28,27.56 0 top
FD1  21.46,63.37 0 top
FD2  21.46,63.37 0 bottom
FD3  0.74,4.14 0 top
FD4  0.74,4.14 0 bottom
FRAME1  -17.14,-20.32 0 top  (outside the outline)
GPIO18PU  16.15,33.27 0 bottom
H1  2.54,2.54 0 top
H2  20.32,2.54 0 top
J2  1.27,24.13 90 top
J3  5.08,9.4 270 top
J4  21.59,13.97 90 top
J5  11.43,6.6 0 top
J6  17.33,28.66 90 top
J7  8.89,41.91 180 bottom
JP2  3.48,17.78 90 top
LOGO1  15.15,24.06 0 top
LOGO2  11.43,3.81 0 bottom
LOGO3  11.56,60.07 0 bottom
LOGO4  30.48,39.37 0 top  (outside the outline)
LOGO6  4.5,5.67 0 top
Q1  12.06,20.95 90 top
Q2  16.28,21.1 270 top
R1  18.98,19.86 180 top
R2  9.45,14.1 90 top
R3  19.38,6.65 0 top
R4  3.75,30.07 270 top
R5  19.83,13.01 90 top
R6  10.29,24.83 180 top
R7  11.88,18.07 90 top
R8  3.12,24.51 270 top
R9  20.34,11.35 180 top
R10  21.97,54.36 270 top
R11  14.17,8.69 270 top
R12  10.53,14.09 270 top
R13  10.26,23.14 0 top
R14  19.41,26.7 270 top
R17  18.54,22.35 270 top
R18  19.76,22.35 90 top
S1  16.71,10.41 270 top
S2  7.78,10.41 270 top
TP1  17.78,24.13 0 top
TP2  13.97,48.26 0 bottom
TP3  14.61,45.72 0 bottom
TP4  14.61,40.64 0 bottom
TP5  13.97,50.8 0 bottom
U1  11.43,45.09 90 top
U2  16.14,16.41 0 top
U3  5.87,24.74 270 top
U4  12.7,27.3 90 top
U5  11.43,8.89 0 top
U$1  [#CP210X#0]  5.54,12.24 90 bottom
U$2  [SDI0]  21.62,43.18 0 top
U$3  [CHG0]  11.99,25.09 90 bottom
U$4  [#500#0]  9.03,23.74 90 bottom
U$5  [ESP32#S20]  11.31,57.67 0 bottom
U$6  [SDO0]  21.69,40.64 0 top
U$7  [#RST#0]  21.54,12.6 0 top
U$8  [#46#0]  5.07,45.55 90 bottom
U$9  [#ESP32#0]  5.61,14.96 90 bottom
U$10  [#45#0]  7.63,45.59 90 bottom
U$11  [MA0]  10.91,25.16 90 bottom
U$12  [#A5#0]  21.38,36.84 0 bottom
U$14  [USB0]  7.34,13.75 90 bottom
U$15  [110]  1.27,35.56 0 top
U$16  [#GPIO18PU#0]  15.34,33.25 0 bottom
U$17  [100]  1.27,38.1 0 top
U$18  [80]  1.27,40.64 0 top
U$19  [#A4#0]  21.38,34.3 0 bottom
U$20  [60]  1.27,43.18 0 top
U$21  [#A2#0]  21.41,29.18 0 bottom
U$22  [#A3#0]  21.42,31.74 0 bottom
U$23  [40]  1.27,45.72 0 top
U$24  [330]  21.59,45.72 0 top
U$25  [SDA0]  1.27,50.8 0 top
U$26  [SCL0]  1.27,48.26 0 top
U$28  [#A0#0]  21.38,24.14 0 bottom
U$29  [340]  21.59,48.26 0 top
U$30  [30]  21.59,50.8 0 top
U$31  [#36#SCK#0]  21.39,39.37 0 bottom
U$32  [#GND#0]  21.38,21.6 0 bottom
U$33  [#35#COPI#0]  21.39,41.91 0 bottom
U$34  [#37#CIPO#0]  21.39,44.45 0 bottom
U$35  [#33#RX1#0]  21.39,46.99 0 bottom
U$36  [#34#TX1#0]  21.39,49.53 0 bottom
U$37  [#3#0]  21.39,52.07 0 bottom
U$38  [#41#MTDI#0]  12.7,45.61 90 bottom
U$39  [#12#0]  1.5,34.29 0 bottom
U$40  [#13#0]  1.5,31.75 0 bottom
U$41  [#VUSB#0]  1.5,29.21 0 bottom
U$42  [#VBAT#0]  1.5,24.13 0 bottom
U$43  [#EN#0]  1.5,26.67 0 bottom
U$44  [#NC#0]  21.38,19.06 0 bottom
U$45  [#3V3#0]  21.38,16.52 0 bottom
U$46  [##RESET##0]  21.38,13.98 0 bottom
U$47  [#11#0]  1.47,36.82 0 bottom
U$48  [#6#0]  1.47,44.44 0 bottom
U$49  [#8#0]  1.47,41.9 0 bottom
U$50  [#10#0]  1.47,39.36 0 bottom
U$51  [#4#0]  1.47,46.98 0 bottom
U$52  [#1#SDA#0]  1.47,52.06 0 bottom
U$53  [#2#SCL#0]  1.47,49.52 0 bottom
U$54  [#21#0]  5.09,38.24 90 bottom
U$55  [#26#0]  7.62,38.22 90 bottom
U$56  [#TX0#0]  10.17,38.21 90 bottom
U$57  [#38#0]  12.7,38.2 90 bottom
U$58  [#RX0#0]  10.16,45.62 90 bottom
U$59  [ORDERING_INSTRUCTIONS]  29.21,50.8 0 top  (outside the outline)
U$60  [#100#0]  9.03,26.41 90 bottom
U$61  [THING_PLUS0]  11.3,56 0 bottom
U$62  [THING_PLUS_0]  12.48,30.78 0 top
U$63  [ESP32#S2_0]  12.48,32 0 top
U$64  [#A1#0]  21.36,26.68 0 bottom
U$72  [120]  1.27,33.02 0 top
U$73  [130]  1.27,30.48 0 top
U$74  [130]  5.32,28.57 0 top
U$75  [VUSB0]  1.75,27.94 0 top
U$76  [EN0]  1.27,25.43 0 top
U$77  [VBAT0]  2.06,22.73 0 top
U$78  [CHG0]  21.89,8.97 90 top
U$79  [RESET0]  18.73,10.56 90 top
U$81  [3V30]  21.59,15.24 0 top
U$82  [NC0]  21.59,17.78 0 top
U$83  [GND0]  21.59,20.32 0 top
U$84  [A00]  21.59,22.86 0 top
U$85  [A10]  21.59,25.4 0 top
U$86  [A20]  21.59,27.94 0 top
U$87  [A30]  21.59,30.48 0 top
U$88  [A40]  21.59,33.02 0 top
U$89  [A50]  21.59,35.56 0 top
U$90  [SCK0]  21.69,38.1 0 top
U$96  [00]  9.91,10.43 0 top
USB  5.61,13.59 270 bottom
Y1  6.57,30.47 180 top

### Tracks (layer width: path | path; a pad name or v marks a point on that pad's centre or on a via)
0  (via drill 0.38)
  Top 0.203: Q2.6 17.77,21.75 17.93,21.92 17.93,22.28 17.8,22.4 17.25,22.4 v17.22,22.43 | S2.4 8.58,15.41 9.07,15.9 11.71,15.9 12.64,16.84 12.64,17.56 13.79,18.71 13.79,23.39 v14.5,24.11 14.53,24.13 TP1.P$1 | v15.65,54 15.62,54.02 U1.3
  Bottom 0.203: v17.22,22.43 17.22,23.57 TP1.P$1 | v15.65,54 15.82,53.82 15.82,50.85 15.16,50.19 15.16,49.1 15.7,48.56 15.7,38.8 14.63,37.74 14.63,35.65 13.6,34.62 13.6,26.66 14.63,25.63 14.63,24.23 v14.5,24.11
3
  Top 0.203: U1.6 4.58,49.52 7.09,52.04 11.25,52.04 11.53,51.76 21.28,51.76 J4.16
3.3V  (via drill 0.25, 0.3, 0.38)
  Top 0.178: R2.1 9.45,12.97 v9.85,12.58 | J6.1 18.05,26.2 R14.2
  Top 0.203: R10.2 21.23,53.86 v21.21,53.83 | v10.26,29.17 v10.25,29.18 | U2.6 13.15,15.16 | 13.14,15.17 13.14,15.16 13.14,15.2 13.15,15.21 | R1.1 19.48,20.46 19.61,20.58 v20.01,20.58 | U5.9 v11.43,10.77
  Top 0.254: U2.5 13.37,15.66 13.14,15.44 13.14,15.2 | 13.15,15.21 13.15,15.16 | 13.14,15.17 13.14,14.49 13.51,14.12 C3.1 | U2.7 14.89,13.54 14.73,13.37 14.39,13.37 14.25,13.51 C3.1 | C3.1 C2.1 13.51,11.86 13.72,11.66 v13.83,11.66
  Top 0.508: J3.2 6.31,9.9 v6.36,9.94 | U1.2 v1.64,55.52 v1.63,55.53 | v10.25,29.18 | U3.5 8.45,25.69 8.82,26.07 C10.1 C1.1 9.37,27.93 10.26,28.82 v10.26,29.17
  Route15 0.178: v9.85,12.58 10.73,11.69 10.73,11.63
  Route15 0.254: v11.43,10.77 11.43,11.63 | v13.83,11.66 v13.83,11.65 13.83,11.63
  Route15 0.508: v6.36,9.94 9.04,9.94 10.73,11.63 11.43,11.63 13.83,11.63 15.33,11.63
  pour Route15 (isolate 0.254, rank 2): 0,57.78 22.86,57.78 22.86,0 0,0
4
  Top 0.203: U1.7 1.49,48.02 1.27,47.8 J2.10
6
  Top 0.203: U1.9 1.84,45.02 J2.9
8
  Top 0.203: U1.11 1.39,42.02 J2.8
10
  Top 0.203: U1.13 1.61,39.02 J2.7
11
  Top 0.203: U1.14 3.06,37.4 1.82,37.4 1.27,36.86 J2.6
12
  Top 0.203: U1.15 2.85,35.7 1.62,35.7 1.27,35.34 J2.5
13
  Top 0.203: U1.16 3.18,31.75 3.19,31.75 | R4.1 3.75,31.19 3.19,31.75 | 3.19,31.75 J2.4
21  (via drill 0.3)
  Top 0.203: U1.24 15.18,36.1 13.6,37.68 6.62,37.68 v5.7,36.75
  Bottom 0.203: v5.7,36.75 5.08,37.37 J7.2
26  (via drill 0.3)
  Top 0.203: U1.25 16.63,34.32 16.63,35.57 14.05,38.15 7.57,38.15 v6.35,39.37
  Bottom 0.203: v6.35,39.37 J7.4
33/RX1  (via drill 0.3)
  Top 0.203: U1.27 19.67,33.64 v19.68,33.63
  Bottom 0.203: v19.68,33.63 19.42,33.89 18.03,33.89 16.46,35.46 16.46,36.87 17.37,37.77 17.37,40.44 19.7,42.78 19.7,44.6 20.76,45.65 21.37,45.65 21.59,45.88 J4.14
34/TX1
  Top 0.203: U1.28 18.71,36.02 18.57,36.16 18.57,36.99 14.78,40.79 12.7,40.79 12.28,41.21 12.28,42.15 14.26,44.13 14.26,48.34 14.7,48.78 20.84,48.78 J4.15
38  (via drill 0.3)
  Top 0.203: U1.32 13.12,42.02 v12.92,41.82
  Bottom 0.203: v12.92,41.82 12.7,41.6 J7.8
41/MTDI  (via drill 0.3)
  Top 0.203: U1.35 15.06,46.52 v14.87,46.71
  Route15 0.203: J6.8 15.96,30.66 15.96,45.62 | 15.96,45.62 v14.87,46.71 | 15.96,45.62
  Bottom 0.203: v14.87,46.71 13.97,46.71 | 13.97,46.71 13.26,46.71 12.7,46.15 J7.7 | TP2.P$1 13.97,46.71
45  (via drill 0.3)
  Top 0.203: U1.39 6.67,52.52 v6.33,52.87
  Bottom 0.203: v6.33,52.87 6.33,48.23 7.62,46.94 J7.3
46  (via drill 0.3)
  Top 0.203: U1.40 16.81,54.02 16.2,53.42 5.7,53.42 v5.63,53.35
  Bottom 0.203: v5.63,53.35 5.63,49.47 5.08,48.91 J7.1
A0
  Top 0.203: U1.20 9.18,33.47 10.85,31.8 15.39,31.8 15.89,31.29 15.89,25.64 16.28,25.25 21.39,25.25 21.59,25.06 J4.5
A1  (via drill 0.25)
  Top 0.203: U1.21 10.77,34.18 10.77,32.99 11.54,32.22 19.59,32.22 20.36,31.45 v20.36,30.48 20.36,26.89 20.58,26.67 J4.6
  Bottom 0.178: v20.36,30.48 20.04,30.8 20.04,31.88 18.64,33.27 GPIO18PU.1
A2  (via drill 0.3)
  Top 0.203: U1.17 4.68,33.31 4.4,33.03 4.01,33.03 3.62,32.64 3.62,31.92 4.39,31.14 4.39,29.48 4.73,29.14 8.56,29.14 10.83,31.41 15.05,31.41 15.43,31.03 15.43,25.45 16.13,24.75 18.76,24.75 18.77,24.76 19.58,24.76 v19.63,24.72
  Bottom 0.203: v19.63,24.72 20.36,25.45 20.36,28.92 20.65,29.21 J4.7
A3
  Top 0.203: J4.8 20.66,31.75 19.78,32.63 12.09,32.63 11.42,33.3 11.42,35.26 11.2,35.48 5.02,35.48 4.32,36.18 4.32,40.29 4.08,40.52 U1.12
A4
  Top 0.203: J4.9 21.59,33.28 21.37,33.05 14.69,33.05 14.45,33.29 14.45,36.16 13.43,37.17 12.56,37.17 11.33,35.94 5.26,35.94 4.8,36.4 4.8,43.25 4.53,43.52 U1.10
A5  (via drill 0.3)
  Top 0.203: U1.8 4.18,46.52 5.38,45.33 5.38,41.58 8.3,38.65 14.25,38.65 16.44,36.46 v17.05,36.46
  Bottom 0.203: J4.10 20.7,36.83 20.33,36.46 v17.05,36.46
CC1
  Top 0.178: J5.A5 10.18,7.62 9.43,8.36 9.43,10.39 10.53,11.49 R12.2
CC2
  Top 0.178: J5.B5 13.18,7.82 13.55,8.19 R11.2
CHG  (via drill 0.3, 0.38)
  Top 0.178: D1.C 13.55,9.82 v13.49,9.88
  Top 0.203: v14.02,25.4 14,25.42 U4.1
  Bottom 0.203: v14.02,25.4 11.96,23.34 11.96,11.71 13.49,10.19 v13.49,9.88
CHIP_PU  (via drill 0.38)
  Top 0.178: v16.79,11.48 17.4,11.48 17.51,11.6 S1.4
  Top 0.203: Q2.3 v14.48,20.45 | v16.46,54.66 17.32,55.52 U1.41 21.97,55.52 | R10.1 21.97,55.52 | C8.1 21.97,55.52
  Bottom 0.203: J4.1 21.59,12.37 20.7,11.48 v16.79,11.48 16.79,12.45 17.75,13.41 17.75,18.82 | v16.46,54.66 16.46,51.79 17.09,51.16 17.09,49.12 16.88,48.91 16.88,37.91 15.97,37 15.97,35.05 14.92,34 14.92,31.43 14.93,31.43 14.93,31.2 | 17.75,18.82 17.75,19.99 17.35,20.4 17.09,20.4 15.83,21.66 15.83,26.28 14.93,27.18 14.93,31.2 | v14.48,20.45 14.48,19.91 15.6,18.8 17.73,18.8 17.75,18.82 | J6.10 14.93,31.2
CIPO  (via drill 0.3)
  Top 0.203: U1.31 18.37,40.52 v18.34,40.5
  Bottom 0.203: v18.34,40.5 20.19,42.35 20.19,44.08 20.56,44.45 J4.13
COPI  (via drill 0.3)
  Top 0.203: U1.29 18.69,37.52 18.34,37.87 v18.34,38.53
  Bottom 0.203: v18.34,38.53 20.01,40.2 20.01,41.31 20.6,41.91 J4.12
CP210X_D+
  Top 0.203: U2.3 13.05,16.66 11.22,14.84 11.22,11.39 10.2,10.37 10.2,9.22 10.34,9.09 U5.1
CP210X_D-
  Top 0.203: U2.4 13.06,16.16 11.72,14.82 11.72,11.28 12.63,10.37 12.63,9.25 12.47,9.09 U5.7
DTR
  Top 0.203: Q2.1 14.82,21.75 14.63,21.95 14.63,22.4 15.23,23 16.1,23 | U2.23 15.39,19.55 16.1,20.27 16.1,23 | R17.1 18.39,23 16.1,23
EN
  Top 0.203: J2.2 1.27,25.59 1.48,25.37 2.18,25.37 2.46,25.09 2.46,24.4 2.78,24.07 3.06,24.07 R8.2 3.6,24.01 3.82,23.79 U3.3
ESP32_D+  (via drill 0.3)
  Top 0.203: v10.02,8.69 U5.2 | v12.96,36.58 v12.96,36.59 13.16,36.59 13.68,36.07 U1.23
  Bottom 0.203: v10.02,8.69 10.02,10.2 11.18,11.36 11.18,35.86 11.9,36.58 v12.96,36.58
ESP32_D-  (via drill 0.3)
  Top 0.203: v12.79,8.69 U5.6 | v13.15,35.85 12.38,35.85 12.18,35.66 U1.22
  Bottom 0.203: v12.79,8.69 12.79,10.17 11.54,11.42 11.54,35.64 12.08,36.18 12.57,36.18 12.9,35.85 v13.15,35.85
GND  (via drill 0.25)
  Top 0.178: 13.18,17.16 13.17,17.15
  Top 0.203: 15.07,17.17 15.06,17.16 U2.2 13.18,17.16 | U5.8 11.83,10.17 v11.95,10.29 | U5.4 v11.44,7.4
  other vias: 16.08,16.39 7.57,7.3 6.65,7.34 15.27,7.25 16.24,7.25 12.46,14.3 4.25,32.35 9.08,32.68 12.2,24.9 13.02,27.3 13.16,17.31 10.53,15.34 13.77,10.84 12.86,30.09 1.89,57.06 4.48,57.08 18.37,57.08 20.89,57.08 5.52,24.72 18.17,35.49 6.17,26.57 11.02,50.46 9.5,50.47 9.52,48.96 11.02,48.94 11.01,47.42 9.51,47.46 12.57,48.98 7.84,48.96 10.29,51.51 10.28,46.56 8.07,15.76 6.6,15.76 4.59,15.84 4.34,16.52 4.31,17.16 7.31,15.76 15.22,16.39 16.13,17.38 17.05,16.39 16.11,15.43
  pour Route2 (isolate 0.254): 0,57.78 22.86,57.78 22.86,0 0,0
  pour Top (isolate 0.178): 0,0 0,57.78 22.86,57.78 22.86,0
  pour Bottom (isolate 0.178): 0,0 22.86,0 22.86,57.78 0,57.78
MTCK  (via drill 0.3)
  Top 0.203: U1.33 v14.92,43.52
  Route15 0.203: J6.4 14.93,29.16 14.93,43.51 v14.92,43.52
  Bottom 0.203: v14.92,43.52 14.92,43.52 14.61,43.2 TP4.P$1
MTDO  (via drill 0.3)
  Top 0.203: U1.34 15.7,45.02 v15.15,44.47
  Route15 0.203: J6.6 15.5,29.86 15.5,44.12 v15.15,44.47
  Bottom 0.203: v15.15,44.47 15.15,45.18 TP3.P$1
MTMS  (via drill 0.3)
  Top 0.203: U1.36 14.9,48.02 v14.88,48
  Route15 0.203: J6.2 14.48,28.34 14.48,43.06 14.26,43.29 14.26,47.38 v14.88,48
  Bottom 0.203: TP5.P$1 13.97,49.68 14.88,48.77 v14.88,48
N$1
  Top 0.203: U2.9 15.89,13.67 15.96,13.6 18.05,13.6 19.06,14.61 19.06,18.12 18.48,18.7 R1.2
N$2
  Top 0.203: R4.2 3.75,29.07 4.4,28.42 D3.A
N$3  (via drill 0.3)
  Top 0.203: J5.B6 v12.18,5.27 v12.19,5.26 | v11.17,5.24 11.18,5.24 J5.A6 11.18,6.97 10.94,7.21 10.94,7.58 11.03,7.67 U5.3
  Bottom 0.203: v12.19,5.26 11.19,5.26 v11.17,5.24
N$4
  Top 0.203: U2.8 15.39,13.42 15.54,13.27 18.32,13.27 19.07,12.51 R5.1 R9.2
N$5
  Top 0.203: J5.B7 10.68,5.46 10.66,5.43 10.66,4.86 10.87,4.65 11.46,4.65 11.68,4.87 J5.A7 11.68,6.95 11.93,7.2 11.93,7.59 11.83,7.68 U5.5
N$6  (via drill 0.25)
  Top 0.178: v9.45,15.34 R2.2
  Bottom 0.178: USB.1 8.74,14.63 v9.45,15.34
N$7
  Top 0.203: U1.18 6.18,33.15 6,32.96 C5.2 5.99,31.54 5.32,30.87 Y1.P$2
N$8
  Top 0.203: U1.19 7.68,33.36 7.28,32.96 C4.2 7.28,31.43 7.82,30.89 Y1.P$1
N$9  (via drill 0.38)
  Top 0.203: U4.5 10.38,26.36 v10.19,26.16
  Bottom 0.203: v10.19,26.16 10.19,25.5 9.78,25.09 CHG.2
N$10
  Top 0.203: Q2.5 18.33,21.1 18.54,21.31 R17.2
N$11  (via drill 0.38)
  Top 0.203: R13.1 9.71,23.09 v8.97,23.09
  Bottom 0.203: CHG.1 8.23,26.14 8.1,26.01 8.1,23.37 8.38,23.09 v8.97,23.09
N$12
  Top 0.203: R18.2 19.76,23.33 19.62,23.48 14.66,23.48 14.17,22.99 14.17,21.67 14.74,21.1 Q2.2
N$13  (via drill 0.38)
  Top 0.203: R6.2 9.45,24.17 9.65,23.96 v10.31,23.96
  Bottom 0.203: CHG.3 10.22,24.05 v10.31,23.96
N$14  (via drill 0.25)
  Top 0.178: v19.41,28.09 R14.1
  Bottom 0.178: v19.41,28.09 19.41,31.09 18.41,32.08 16.08,32.08 15.75,32.41 GPIO18PU.2
N$17
  Top 0.178: R3.2 19.91,6.68 20.5,6.68 20.7,6.88 D1.A
RTS
  Top 0.203: 17.87,20.45 Q2.4 | R18.1 19.76,21.35 18.86,20.45 17.87,20.45 | U2.19 17.39,19.12 17.87,19.6 17.87,20.45
RX0  (via drill 0.3, 0.38)
  Top 0.203: U2.21 16.39,19.31 v16.18,19.53 | U1.38 16.73,51.02 v16.51,50.8 15.37,50.8 13.29,48.73 13.29,46.31 v11.43,44.45
  Bottom 0.203: v16.18,19.53 15.06,20.66 15.06,25.81 14.01,26.86 14.01,34.38 15.06,35.44 15.06,37.51 16.1,38.55 16.1,48.87 15.67,49.3 15.67,49.99 16.48,50.8 v16.51,50.8 | v11.43,44.45 J7.5
SCK
  Top 0.203: U1.30 21.25,39.02 J4.11
SCL  (via drill 0.38)
  Top 0.203: J3.4 3.71,7.9 2.79,8.81 v2.79,8.87 | U1.5 4.47,51.02 v4.5,51.05
  Bottom 0.203: 3.25,49.53 J2.11 | v2.79,8.87 3.25,9.32 3.25,49.53 | 3.25,49.53 3.25,49.55 4.5,50.8 v4.5,51.05
SDA  (via drill 0.38)
  Top 0.203: J3.3 3.79,8.9 v3.79,8.89 | U1.4 1.73,52.52 J2.12
  Bottom 0.203: J2.12 1.68,51.66 4.78,51.66 5.13,51.31 5.13,50.75 3.63,49.25 3.63,9.04 v3.79,8.89
TX0  (via drill 0.3, 0.38)
  Top 0.203: U2.20 16.89,19.5 v17.09,19.71 | U1.37 v16.51,49.53 14.79,49.53 13.78,48.52 13.78,44.33 10.96,41.51 v10.15,41.51
  Bottom 0.203: v17.09,19.71 15.47,21.34 15.47,26.02 14.45,27.04 14.45,34.2 15.51,35.26 15.51,37.23 16.51,38.24 v16.51,49.53 | J7.6 v10.15,41.51
USB_SEL  (via drill 0.25)
  Top 0.203: v10.93,10.29 11.03,10.19 U5.10
  Bottom 0.178: v10.93,10.29 10.93,8.49 10.44,8 9.63,8 9.04,8.59 9.04,12.95 8.41,13.59 USB.2
V_BATT
  Top 0.508: J2.1 1.25,24.11 1.25,22.78 1.55,22.48 3.89,22.48 4.27,22.1 4.27,19 4.5,18.77 JP2.2 7.17,19.57 7.42,19.81 9.04,19.81 10.19,20.95 Q1.3 11.57,20.95 12.09,21.47 12.09,23.22 12.94,24.07 12.94,26.33 12.37,26.91 12.37,27.65 12.98,28.25 U4.3 14.16,28.25 C6.1
V_USB  (via drill 0.38)
  Top 0.178: R3.1 18.86,6.63 v17.83,6.63
  Top 0.203: R7.2 12.38,19.07 13.06,19.07 | R5.2 19.83,14.62 v19.77,14.68
  Top 0.508: J5.VBUS2 13.88,7.28 v13.87,7.29 | J5.VBUS1 v8.98,7.28 v8.97,7.29 | Q1.1 13.06,19.07 v13.08,19.05 | D2.A v10.54,18.16 | v10.05,27.3 v10.05,27.31 10.05,27.69 10.62,28.25 11.09,28.25 | 11.09,28.25 U4.4 | C19.1 11.1,28.26 11.09,28.25
  Route15 0.203: v19.77,14.68 14.15,14.68 | v17.83,6.63 17.83,5.56 16.28,4.01 14.05,4.01 14.02,4.04
  pour Route15 (isolate 0.254): 14.43,0 14.43,19.61 10.87,23.16 10.87,27.59 7.99,30.48 0,30.48 0,0
VIN  (via drill 0.38)
  Top 0.203: R8.1 3.12,25.52 3.3,25.69 U3.1
  Top 0.508: D2.C 11.56,19.57 12.17,20.17 12.17,20.62 12.45,20.9 12.78,20.9 13.08,21.21 13.08,21.89 Q1.2 13.06,22.97 v13.08,22.99 | U3.1 5.71,25.69 6.16,25.23 6.16,24.16 5.95,23.94 C7.1 5.95,21.38 v6.04,21.29
  Route15 0.508: v13.08,22.99 11.39,21.3 v6.05,21.3 v6.04,21.29

### Text on the board
Top: 1
Route2: 2
Route15: 3
Bottom: 4 | v10
tPlace: + | -
Measures: Measure Units: INCHES
tDocu: Pete Lewis | Based on designs by: M. Hord, A. Wende